# Altium project core.PrjPcb
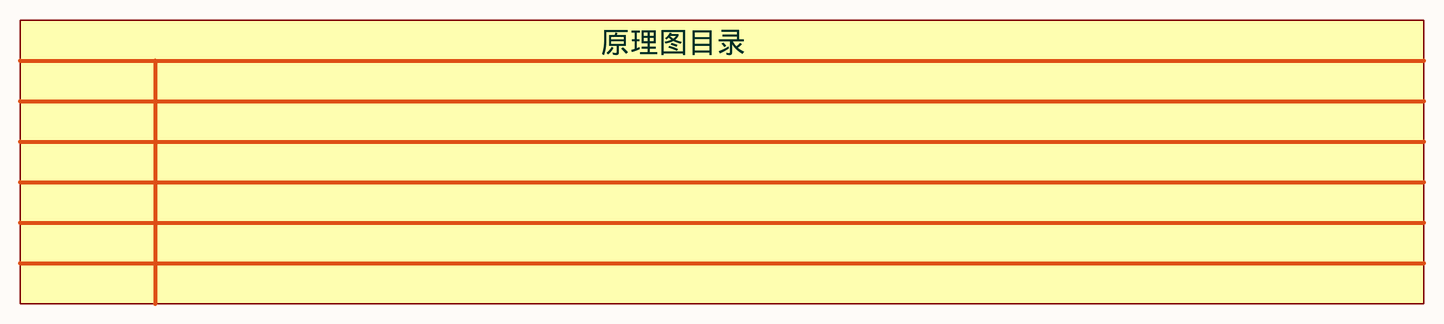
[diagram p0: MYBOARD_01-Contents.SchDoc]
5 sheets, 166 parts. Net scope: flat (ports and power ports of the same name join across sheets).
Board file: MYBOARD.PcbDoc
Sheets:
  MYBOARD_01-Contents.SchDoc
  MYBOARD_02-Power Diagram.SchDoc
  MYBOARD_03-CORE&SRAM.SchDoc
  MYBOARD_04-Other Function.SchDoc
  MYBOARD_05-PWR.SchDoc

## Sheet MYBOARD_01-Contents.SchDoc
size C

### Notes on the sheet
- 原理图目录

## Sheet MYBOARD_02-Power Diagram.SchDoc
size C
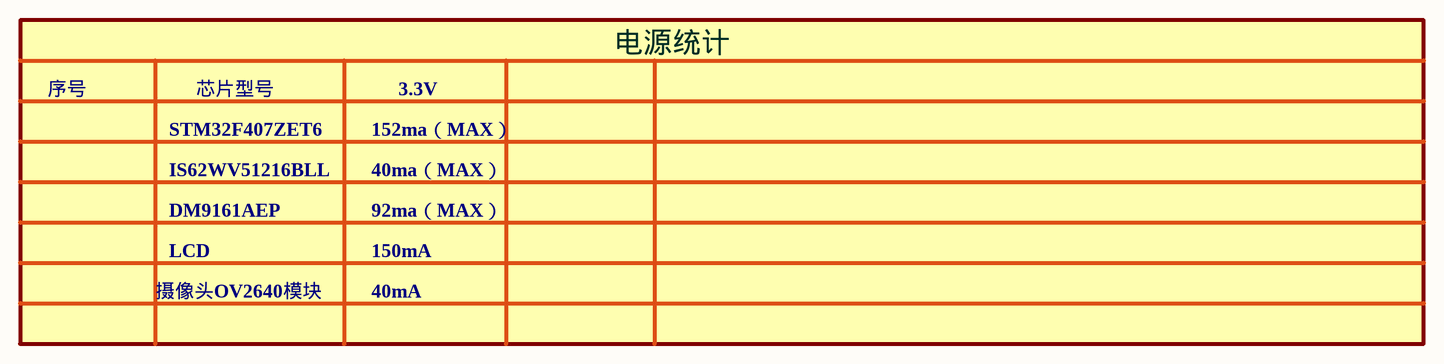
[diagram p1: MYBOARD_02-Power Diagram.SchDoc]

### Notes on the sheet
- 序号
- 芯片型号
- 3.3V
- 电源统计
- STM32F407ZET6
- 152ma（MAX）
- IS62WV51216BLL
- DM9161AEP
- 40ma（MAX）
- 92ma（MAX）
- 摄像头OV2640模块
- LCD
- 150mA
- 40mA

## Sheet MYBOARD_03-CORE&SRAM.SchDoc
size C
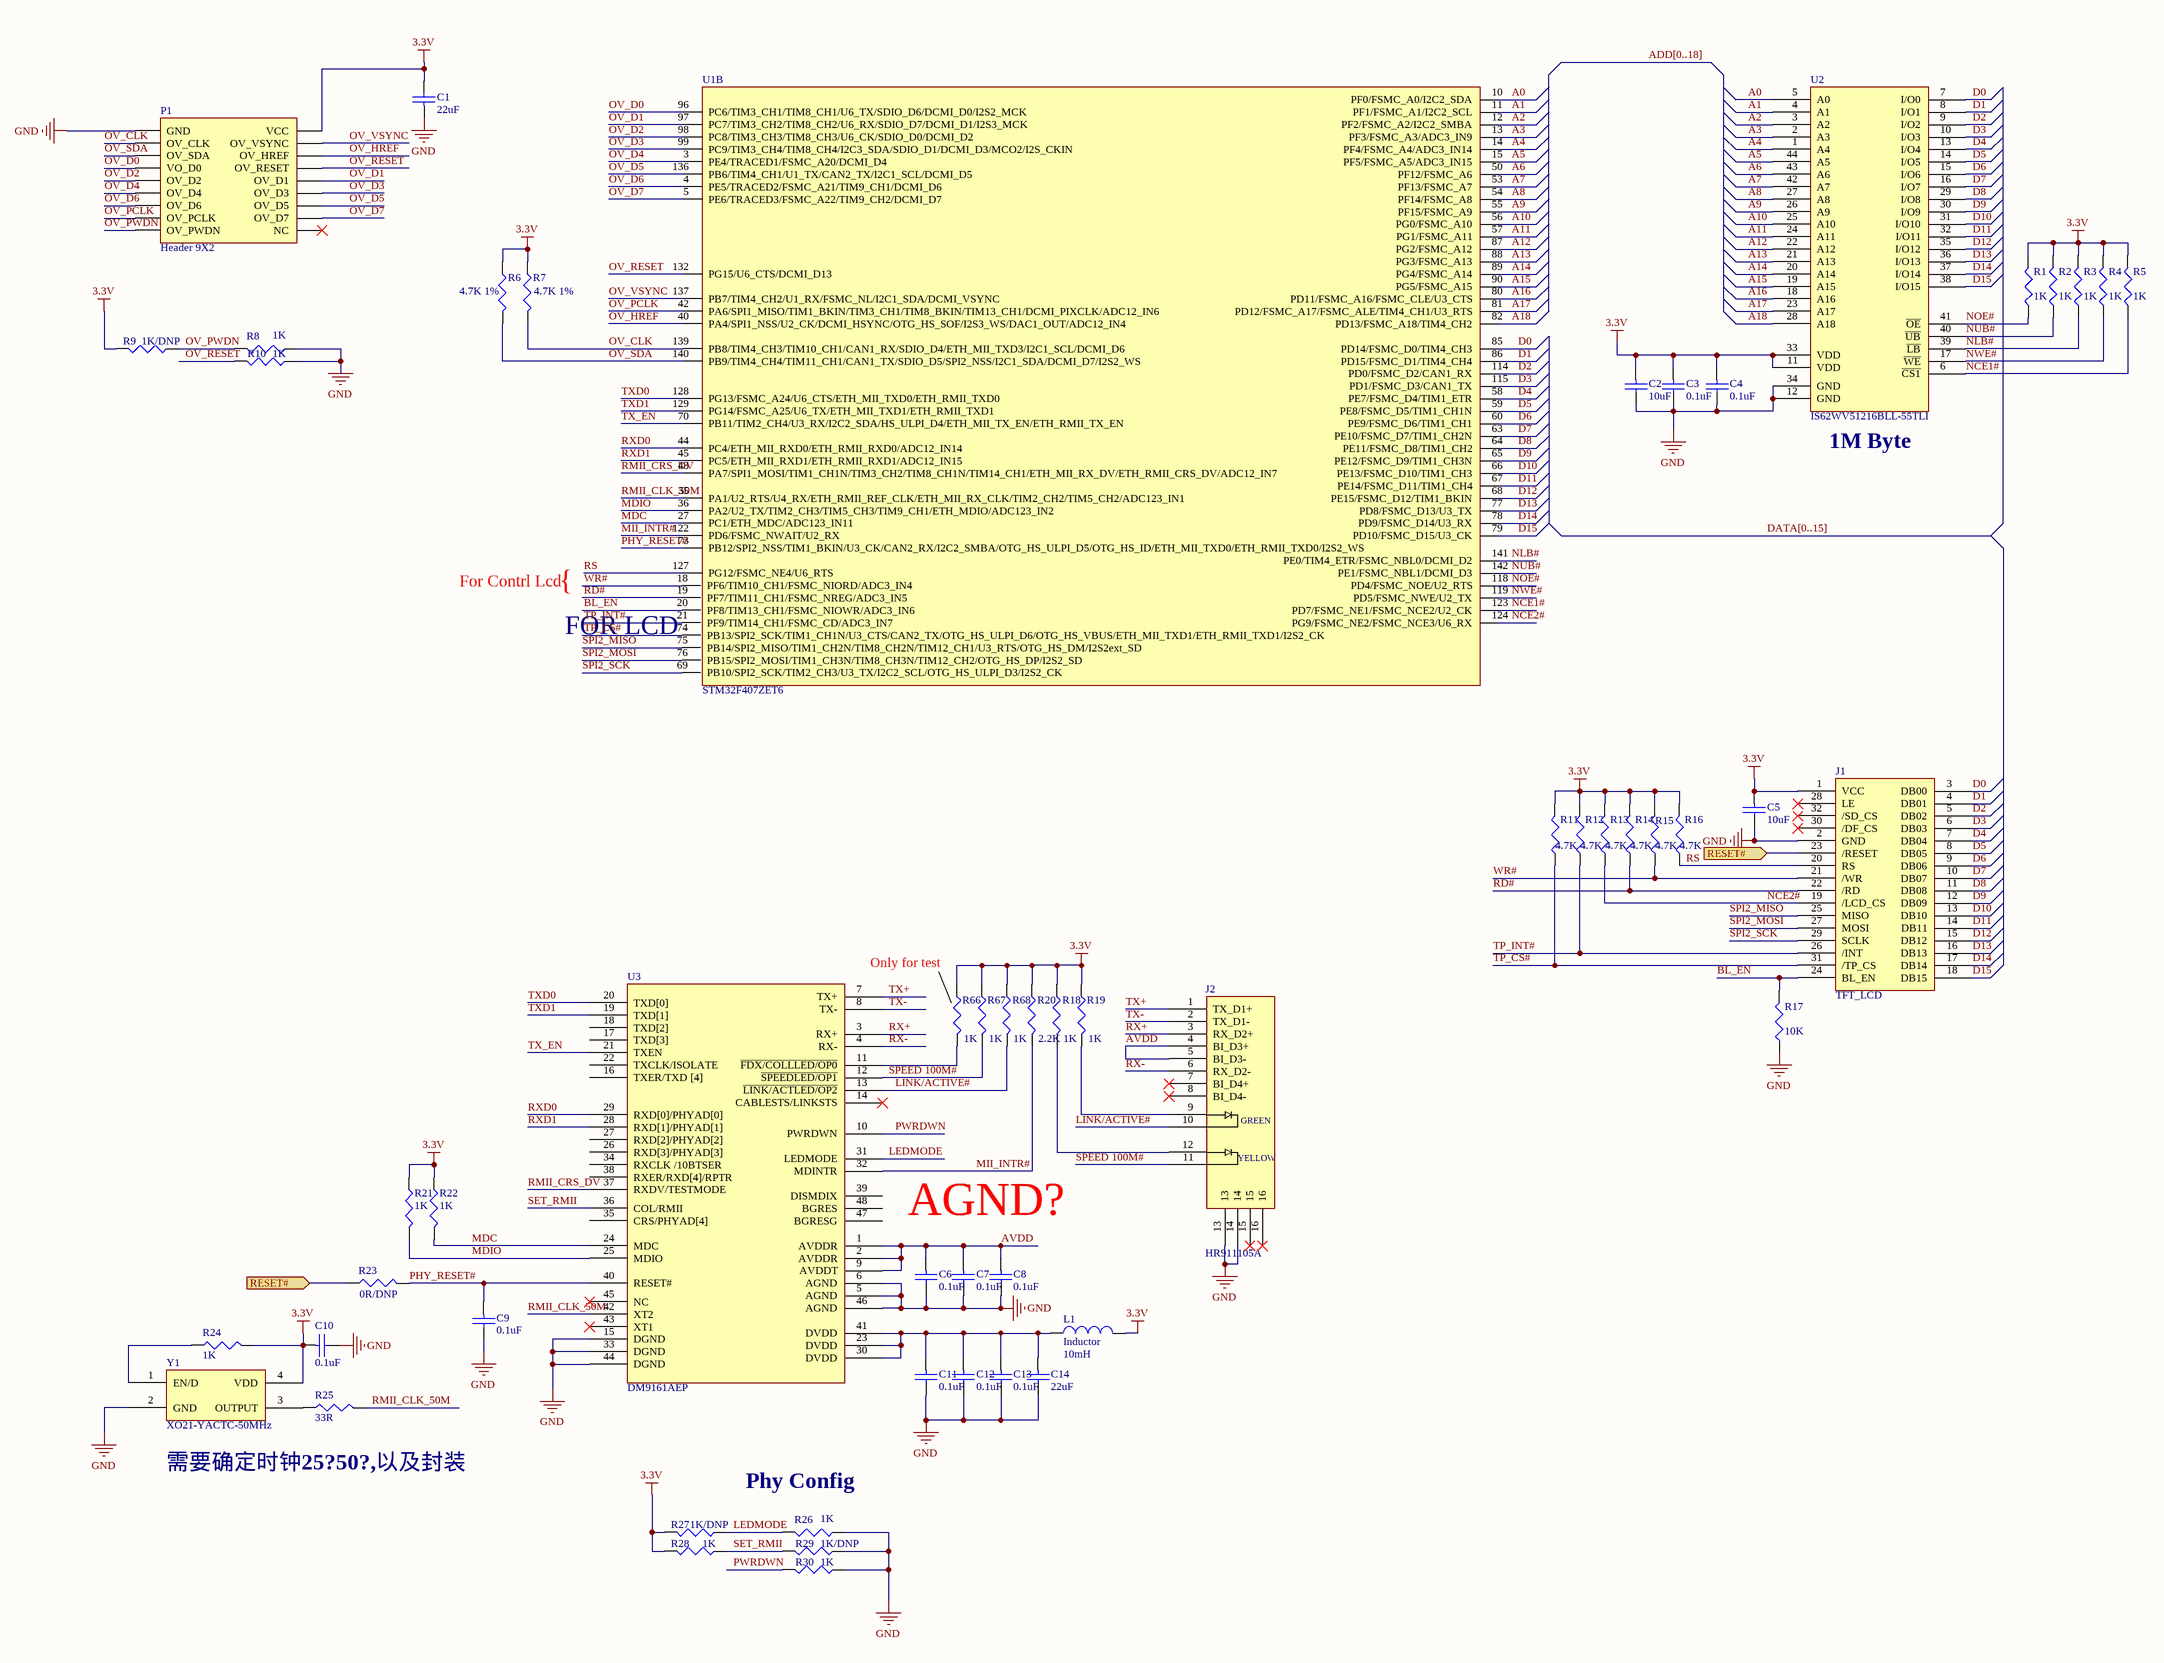
[diagram p2: MYBOARD_03-CORE&SRAM.SchDoc]

### Parts
C1  22uF  [C1206]
C2  10uF  [C0603_DWS]
C3  0.1uF  [C0603_DWS]
C4  0.1uF  [C0603_DWS]
C5  10uF  [C0603_DWS]
C6  0.1uF  [C0603_DWS]
C7  0.1uF  [C0603_DWS]
C8  0.1uF  [C0603_DWS]
C9  0.1uF  [C0603_DWS]
C10  0.1uF  [C0603_DWS]
C11  0.1uF  [C0603_DWS]
C12  0.1uF  [C0603_DWS]
C13  0.1uF  [C0603_DWS]
C14  22uF  [C1206]
J1  TFT_LCD  [TFT LCD]
J2  HR911105A  [HR911105A]
L1  Inductor  value 10mH  [0603]
P1  Header 9X2  [HDR2X9]
R1  value 1K  [R0603_5MIL_DWS]  (hidden comment: Res3)
R2  value 1K  [R0603_5MIL_DWS]  (hidden comment: Res3)
R3  value 1K  [R0603_5MIL_DWS]  (hidden comment: Res3)
R4  value 1K  [R0603_5MIL_DWS]  (hidden comment: Res3)
R5  value 1K  [R0603_5MIL_DWS]  (hidden comment: Res3)
R6  value 4.7K 1%  [R0603_5MIL_DWS]  (hidden comment: Res3)
R7  value 4.7K 1%  [R0603_5MIL_DWS]  (hidden comment: Res3)
R8  value 1K  [R0603_5MIL_DWS]  (hidden comment: Res3)
R9  value 1K/DNP  [R0603_5MIL_DWS]  (hidden comment: Res3)
R10  value 1K  [R0603_5MIL_DWS]  (hidden comment: Res3)
R11  value 4.7K  [R0603_5MIL_DWS]  (hidden comment: Res3)
R12  value 4.7K  [R0603_5MIL_DWS]  (hidden comment: Res3)
R13  value 4.7K  [R0603_5MIL_DWS]  (hidden comment: Res3)
R14  value 4.7K  [R0603_5MIL_DWS]  (hidden comment: Res3)
R15  value 4.7K  [R0603_5MIL_DWS]  (hidden comment: Res3)
R16  value 4.7K  [R0603_5MIL_DWS]  (hidden comment: Res3)
R17  value 10K  [R0603_5MIL_DWS]  (hidden comment: Res3)
R18  value 1K  [R0603_5MIL_DWS]  (hidden comment: Res3)
R19  value 1K  [R0603_5MIL_DWS]  (hidden comment: Res3)
R20  value 2.2K  [R0603_5MIL_DWS]  (hidden comment: Res3)
R21  value 1K  [R0603_5MIL_DWS]  (hidden comment: Res3)
R22  value 1K  [R0603_5MIL_DWS]  (hidden comment: Res3)
R23  value 0R/DNP  [R0603_5MIL_DWS]  (hidden comment: Res3)
R24  value 1K  [R0603_5MIL_DWS]  (hidden comment: Res3)
R25  value 33R  [R0603_5MIL_DWS]  (hidden comment: Res3)
R26  value 1K  [R0603_5MIL_DWS]  (hidden comment: Res3)
R27  value 1K/DNP  [R0603_5MIL_DWS]  (hidden comment: Res3)
R28  value 1K  [R0603_5MIL_DWS]  (hidden comment: Res3)
R29  value 1K/DNP  [R0603_5MIL_DWS]  (hidden comment: Res3)
R30  value 1K  [R0603_5MIL_DWS]  (hidden comment: Res3)
R66  value 1K  [R0603_5MIL_DWS]  (hidden comment: Res3)
R67  value 1K  [R0603_5MIL_DWS]  (hidden comment: Res3)
R68  value 1K  [R0603_5MIL_DWS]  (hidden comment: Res3)
U1  STM32F407ZET6  [LQFP144]  (part B of 3)
U2  IS62WV51216BLL-55TLI  [TSOP80P1180X120-44N]
U3  DM9161AEP  [LQFP-48]
Y1  XO21-YACTC-50MHz  [XO75]

### Ports
RESET#

### Nets
3.3V: C1.2 C2.1 C3.1 C4.1 C5.1 C10.1 J1.1(VCC) L1.2 P1.2(VCC) R1.2 R2.2 R3.2 R4.2 R5.2 R6.1 R7.1 R9.2 R11.2 R12.2 R13.2 R14.2 R15.2 R16.2 R18.1 R19.1 R20.1 R21.1 R22.1 R24.2 R27.2 R28.2 R66.1 R67.1 R68.1 U2.11(VDD) U2.33(VDD) Y1.4(VDD)
GND: C1.1 C2.2 C3.2 C4.2 C5.2 C6.2 C7.2 C8.2 C9.2 C10.2 C11.2 C12.2 C13.2 C14.2 J1.2(GND) J2.13 J2.14 P1.1(GND) R8.1 R10.1 R17.1 R26.1 R29.1 R30.1 U2.12(GND) U2.34(GND) U3.5(AGND) U3.6(AGND) U3.15(DGND) U3.33(DGND) U3.44(DGND) U3.46(AGND) Y1.2(GND)
A0: U1.10(PF0/FSMC_A0/I2C2_SDA) U2.5(A0)
A1: U1.11(PF1/FSMC_A1/I2C2_SCL) U2.4(A1)
A2: U1.12(PF2/FSMC_A2/I2C2_SMBA) U2.3(A2)
A3: U1.13(PF3/FSMC_A3/ADC3_IN9) U2.2(A3)
A4: U1.14(PF4/FSMC_A4/ADC3_IN14) U2.1(A4)
A5: U1.15(PF5/FSMC_A5/ADC3_IN15) U2.44(A5)
A6: U1.50(PF12/FSMC_A6) U2.43(A6)
A7: U1.53(PF13/FSMC_A7) U2.42(A7)
A8: U1.54(PF14/FSMC_A8) U2.27(A8)
A9: U1.55(PF15/FSMC_A9) U2.26(A9)
A10: U1.56(PG0/FSMC_A10) U2.25(A10)
A11: U1.57(PG1/FSMC_A11) U2.24(A11)
A12: U1.87(PG2/FSMC_A12) U2.22(A12)
A13: U1.88(PG3/FSMC_A13) U2.21(A13)
A14: U1.89(PG4/FSMC_A14) U2.20(A14)
A15: U1.90(PG5/FSMC_A15) U2.19(A15)
A16: U1.80(PD11/FSMC_A16/FSMC_CLE/U3_CTS) U2.18(A16)
A17: U1.81(PD12/FSMC_A17/FSMC_ALE/TIM4_CH1/U3_RTS) U2.23(A17)
A18: U1.82(PD13/FSMC_A18/TIM4_CH2) U2.28(A18)
AVDD: C6.1 C7.1 C8.1 J2.4(BI_D3+) J2.5(BI_D3-) U3.1(AVDDR) U3.2(AVDDR) U3.9(AVDDT)
BL_EN: J1.24(BL_EN) R17.2 U1.20(PF8/TIM13_CH1/FSMC_NIOWR/ADC3_IN6)
D0: J1.3(DB00) U1.85(PD14/FSMC_D0/TIM4_CH3) U2.7(I/O0)
D1: J1.4(DB01) U1.86(PD15/FSMC_D1/TIM4_CH4) U2.8(I/O1)
D2: J1.5(DB02) U1.114(PD0/FSMC_D2/CAN1_RX) U2.9(I/O2)
D3: J1.6(DB03) U1.115(PD1/FSMC_D3/CAN1_TX) U2.10(I/O3)
D4: J1.7(DB04) U1.58(PE7/FSMC_D4/TIM1_ETR) U2.13(I/O4)
D5: J1.8(DB05) U1.59(PE8/FSMC_D5/TIM1_CH1N) U2.14(I/O5)
D6: J1.9(DB06) U1.60(PE9/FSMC_D6/TIM1_CH1) U2.15(I/O6)
D7: J1.10(DB07) U1.63(PE10/FSMC_D7/TIM1_CH2N) U2.16(I/O7)
D8: J1.11(DB08) U1.64(PE11/FSMC_D8/TIM1_CH2) U2.29(I/O8)
D9: J1.12(DB09) U1.65(PE12/FSMC_D9/TIM1_CH3N) U2.30(I/O9)
D10: J1.13(DB10) U1.66(PE13/FSMC_D10/TIM1_CH3) U2.31(I/O10)
D11: J1.14(DB11) U1.67(PE14/FSMC_D11/TIM1_CH4) U2.32(I/O11)
D12: J1.15(DB12) U1.68(PE15/FSMC_D12/TIM1_BKIN) U2.35(I/O12)
D13: J1.16(DB13) U1.77(PD8/FSMC_D13/U3_TX) U2.36(I/O13)
D14: J1.17(DB14) U1.78(PD9/FSMC_D14/U3_RX) U2.37(I/O14)
D15: J1.18(DB15) U1.79(PD10/FSMC_D15/U3_CK) U2.38(I/O15)
LEDMODE: R26.2 R27.1 U3.31(LEDMODE)
LINK/ACTIVE#: J2.10 R68.2 U3.13(~{LINK/ACTLED/OP2})
MDC: R22.2 U1.27(PC1/ETH_MDC/ADC123_IN11) U3.24(MDC)
MDIO: R21.2 U1.36(PA2/U2_TX/TIM2_CH3/TIM5_CH3/TIM9_CH1/ETH_MDIO/ADC123_IN2) U3.25(MDIO)
MII_INTR#: R20.2 U1.122(PD6/FSMC_NWAIT/U2_RX) U3.32(MDINTR)
NCE1#: R5.1 U1.123(PD7/FSMC_NE1/FSMC_NCE2/U2_CK) U2.6(~{CS1})
NCE2#: J1.19(/LCD_CS) R13.1 U1.124(PG9/FSMC_NE2/FSMC_NCE3/U6_RX)
NLB#: R3.1 U1.141(PE0/TIM4_ETR/FSMC_NBL0/DCMI_D2) U2.39(~{LB})
NOE#: R1.1 U1.118(PD4/FSMC_NOE/U2_RTS) U2.41(~{OE})
NUB#: R2.1 U1.142(PE1/FSMC_NBL1/DCMI_D3) U2.40(~{UB})
NWE#: R4.1 U1.119(PD5/FSMC_NWE/U2_TX) U2.17(~{WE})
OV_CLK: P1.3(OV_CLK) R7.2 U1.139(PB8/TIM4_CH3/TIM10_CH1/CAN1_RX/SDIO_D4/ETH_MII_TXD3/I2C1_SCL/DCMI_D6)
OV_D0: P1.7(VO_D0) U1.96(PC6/TIM3_CH1/TIM8_CH1/U6_TX/SDIO_D6/DCMI_D0/I2S2_MCK)
OV_D1: P1.10(OV_D1) U1.97(PC7/TIM3_CH2/TIM8_CH2/U6_RX/SDIO_D7/DCMI_D1/I2S3_MCK)
OV_D2: P1.9(OV_D2) U1.98(PC8/TIM3_CH3/TIM8_CH3/U6_CK/SDIO_D0/DCMI_D2)
OV_D3: P1.12(OV_D3) U1.99(PC9/TIM3_CH4/TIM8_CH4/I2C3_SDA/SDIO_D1/DCMI_D3/MCO2/I2S_CKIN)
OV_D4: P1.11(OV_D4) U1.3(PE4/TRACED1/FSMC_A20/DCMI_D4)
OV_D5: P1.14(OV_D5) U1.136(PB6/TIM4_CH1/U1_TX/CAN2_TX/I2C1_SCL/DCMI_D5)
OV_D6: P1.13(OV_D6) U1.4(PE5/TRACED2/FSMC_A21/TIM9_CH1/DCMI_D6)
OV_D7: P1.16(OV_D7) U1.5(PE6/TRACED3/FSMC_A22/TIM9_CH2/DCMI_D7)
OV_HREF: P1.6(OV_HREF) U1.40(PA4/SPI1_NSS/U2_CK/DCMI_HSYNC/OTG_HS_SOF/I2S3_WS/DAC1_OUT/ADC12_IN4)
OV_PCLK: P1.15(OV_PCLK) U1.42(PA6/SPI1_MISO/TIM1_BKIN/TIM3_CH1/TIM8_BKIN/TIM13_CH1/DCMI_PIXCLK/ADC12_IN6)
OV_PWDN: P1.17(OV_PWDN) R8.2 R9.1
OV_RESET: P1.8(OV_RESET) R10.2 U1.132(PG15/U6_CTS/DCMI_D13)
OV_SDA: P1.5(OV_SDA) R6.2 U1.140(PB9/TIM4_CH4/TIM11_CH1/CAN1_TX/SDIO_D5/SPI2_NSS/I2C1_SDA/DCMI_D7/I2S2_WS)
OV_VSYNC: P1.4(OV_VSYNC) U1.137(PB7/TIM4_CH2/U1_RX/FSMC_NL/I2C1_SDA/DCMI_VSYNC)
PHY_RESET#: C9.1 R23.2 U1.73(PB12/SPI2_NSS/TIM1_BKIN/U3_CK/CAN2_RX/I2C2_SMBA/OTG_HS_ULPI_D5/OTG_HS_ID/ETH_MII_TXD0/ETH_RMII_TXD0/I2S2_WS) U3.40(RESET#)
PWRDWN: R30.2 U3.10(PWRDWN)
RD#: J1.22(/RD) R14.1 U1.19(PF7/TIM11_CH1/FSMC_NREG/ADC3_IN5)
RESET#: J1.23(/RESET) R23.1 ; port RESET#
RMII_CLK_50M: R25.2 U1.35(PA1/U2_RTS/U4_RX/ETH_RMII_REF_CLK/ETH_MII_RX_CLK/TIM2_CH2/TIM5_CH2/ADC123_IN1) U3.42(XT2)
RMII_CRS_DV: U1.43(PA7/SPI1_MOSI/TIM1_CH1N/TIM3_CH2/TIM8_CH1N/TIM14_CH1/ETH_MII_RX_DV/ETH_RMII_CRS_DV/ADC12_IN7) U3.37(RXDV/TESTMODE)
RS: J1.20(RS) R16.1 U1.127(PG12/FSMC_NE4/U6_RTS)
RX+: J2.3(RX_D2+) U3.3(RX+)
RX-: J2.6(RX_D2-) U3.4(RX-)
RXD0: U1.44(PC4/ETH_MII_RXD0/ETH_RMII_RXD0/ADC12_IN14) U3.29(RXD[0]/PHYAD[0])
RXD1: U1.45(PC5/ETH_MII_RXD1/ETH_RMII_RXD1/ADC12_IN15) U3.28(RXD[1]/PHYAD[1])
SET_RMII: R28.1 R29.2 U3.36(COL/RMII)
SPEED 100M#: J2.11 R67.2 U3.12(~{SPEEDLED/OP1})
SPI2_MISO: J1.25(MISO) U1.75(PB14/SPI2_MISO/TIM1_CH2N/TIM8_CH2N/TIM12_CH1/U3_RTS/OTG_HS_DM/I2S2ext_SD)
SPI2_MOSI: J1.27(MOSI) U1.76(PB15/SPI2_MOSI/TIM1_CH3N/TIM8_CH3N/TIM12_CH2/OTG_HS_DP/I2S2_SD)
SPI2_SCK: J1.29(SCLK) U1.69(PB10/SPI2_SCK/TIM2_CH3/U3_TX/I2C2_SCL/OTG_HS_ULPI_D3/I2S2_CK)
TP_CS#: J1.31(/TP_CS) R11.1 U1.74(PB13/SPI2_SCK/TIM1_CH1N/U3_CTS/CAN2_TX/OTG_HS_ULPI_D6/OTG_HS_VBUS/ETH_MII_TXD1/ETH_RMII_TXD1/I2S2_CK)
TP_INT#: J1.26(/INT) R12.1 U1.21(PF9/TIM14_CH1/FSMC_CD/ADC3_IN7)
TX+: J2.1(TX_D1+) U3.7(TX+)
TX-: J2.2(TX_D1-) U3.8(TX-)
TX_EN: U1.70(PB11/TIM2_CH4/U3_RX/I2C2_SDA/HS_ULPI_D4/ETH_MII_TX_EN/ETH_RMII_TX_EN) U3.21(TXEN)
TXD0: U1.128(PG13/FSMC_A24/U6_CTS/ETH_MII_TXD0/ETH_RMII_TXD0) U3.20(TXD[0])
TXD1: U1.129(PG14/FSMC_A25/U6_TX/ETH_MII_TXD1/ETH_RMII_TXD1) U3.19(TXD[1])
WR#: J1.21(/WR) R15.1 U1.18(PF6/TIM10_CH1/FSMC_NIORD/ADC3_IN4)
NetC11_1: C11.1 C12.1 C13.1 C14.1 L1.1 U3.23(DVDD) U3.30(DVDD) U3.41(DVDD)
NetJ2_9: J2.9 R19.2
NetJ2_12: J2.12 R18.2
NetR24_1: R24.1 Y1.1(EN/D)
NetR25_1: R25.1 Y1.3(OUTPUT)
NetR66_2: R66.2 U3.11(~{FDX/COLLLED/}~{OP0})

Not connected (* = marked no-connect by the designer): J1 28(LE)* 30(/DF_CS)* 32(/SD_CS)*; J2 7(BI_D4+)* 8(BI_D4-)* 15* 16*; P1 18(NC)*; U3 14(CABLESTS/LINKSTS)* 16(TXER/TXD_[4]) 17(TXD[3]) 18(TXD[2]) 22(TXCLK/ISOLATE) 26(RXD[3]/PHYAD[3]) 27(RXD[2]/PHYAD[2]) 34(RXCLK_/10BTSER) 35(CRS/PHYAD[4]) 38(RXER/RXD[4]/RPTR) 39(DISMDIX) 43(XT1)* 45(NC)* 47(BGRESG) 48(BGRES)

### Buses and harness runs
bus ADD[0..18]
bus DATA[0..15]

### Notes on the sheet
- (near U2) 1M Byte
- For Contrl Lcd
- {
- FOR LCD
- Only for test
- AGND?
- 需要确定时钟25?50?,以及封装
- Phy Config
- (in symbol RJ45,10/100 Base -TX,有变压器) GREEN; YELLOW

### Library data of the parts
C1-C14 = CAP: Capacitor
J1 = TFT_LCD: 320x240,32PIN,
J2 = RJ45,10/100 Base -TX,有变压器
L1 = Inductor: Code_IEC: 1005; Published: 8-Jun-2000; LatestRevisionDate: 29-May-2009; LatestRevisionNote: IPC-7351 Footprint Added.; PackageReference: 0402-A; Publisher: Altium Limited; PackageDescription: Chip Inductor; Code_JEITA: 0402
P1 = Header 9X2: Header, 9-Pin, Dual row; LatestRevisionDate: 17-Jul-2002; LatestRevisionNote: Re-released for DXP Platform.; Publisher: Altium Limited
R1-R30 R66-R68 = Res3: Resistor; Published: 8-Jun-2000; LatestRevisionDate: 29-May-2009; LatestRevisionNote: IPC-7351 Footprint Added.; PackageReference: J1-0603; Publisher: Altium Limited; PackageDescription: Chip Resistor
Y1 = Oscillator: 3.3V,Crystal Oscillator,25M,,Size 2.05×1.65×0.85 mm

## Sheet MYBOARD_04-Other Function.SchDoc
size B
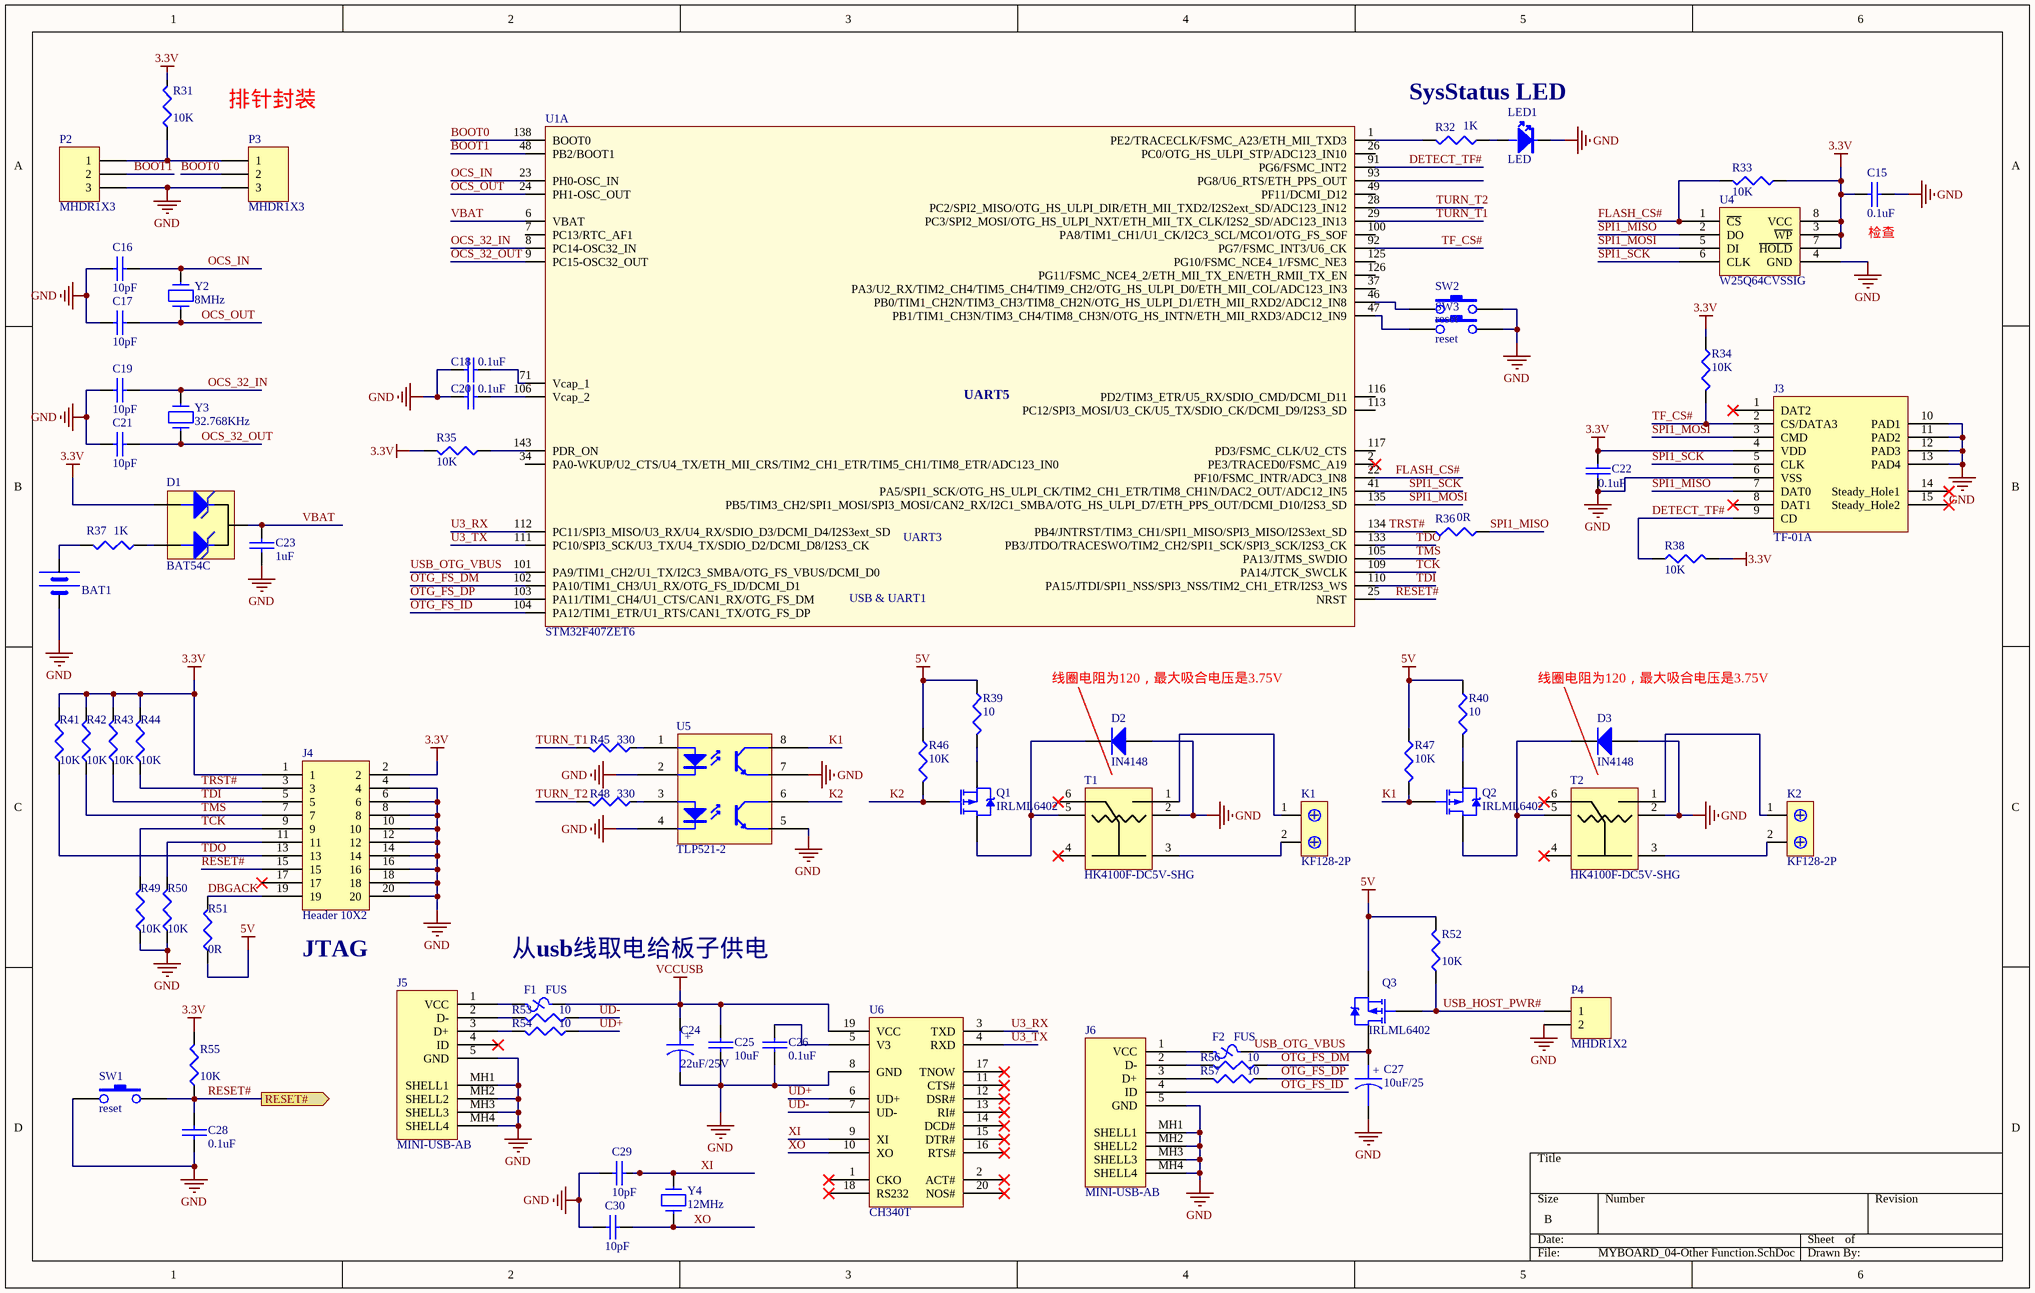
[diagram p3: MYBOARD_04-Other Function.SchDoc]

### Parts
BAT1  BATT  [BC501SM]  (value not drawn)
C15  0.1uF  [C0603_DWS]
C16  10pF  [C0603_DWS]
C17  10pF  [C0603_DWS]
C18  0.1uF  [C0603_DWS]
C19  10pF  [C0603_DWS]
C20  0.1uF  [C0603_DWS]
C21  10pF  [C0603_DWS]
C22  0.1uF  [C0603_DWS]
C23  1uF  [C0603_DWS]
C24  22uF/25V  [CAPAE7053X56M]
C25  10uF  [C0603_DWS]
C26  0.1uF  [C0603_DWS]
C27  10uF/25  [CAPAE7053X56M]
C28  0.1uF  [C0603_DWS]
C29  10pF  [C0603_DWS]
C30  10pF  [C0603_DWS]
D1  BAT54C  [BAT54C]
D2  IN4148  [1N4148WS]
D3  IN4148  [1N4148WS]
F1  FUS  [1206]
F2  FUS  [1206]
J3  TF-01A  [TF-01A]
J4  Header 10X2  [HDR2X10H]
J5  MINI-USB-AB  [MINI-B]
J6  MINI-USB-AB  [MINI-B]
K1  KF128-2P  [KF128-2P]
K2  KF128-2P  [KF128-2P]
LED1  LED  [LED-0603]
P2  MHDR1X3  [HN1X3]
P3  MHDR1X3  [HN1X3]
P4  MHDR1X2  [JP1]
Q1  IRLML6402  [SOTFL95P264X112-3N]
Q2  IRLML6402  [SOTFL95P264X112-3N]
Q3  IRLML6402  [SOTFL95P264X112-3N]
R31  value 10K  [R0603_5MIL_DWS]  (hidden comment: Res3)
R32  value 1K  [R0603_5MIL_DWS]  (hidden comment: Res3)
R33  value 10K  [R0603_5MIL_DWS]  (hidden comment: Res3)
R34  value 10K  [R0603_5MIL_DWS]  (hidden comment: Res3)
R35  value 10K  [R0603_5MIL_DWS]  (hidden comment: Res3)
R36  value 0R  [R0603_5MIL_DWS]  (hidden comment: Res3)
R37  value 1K  [R0603_5MIL_DWS]  (hidden comment: Res3)
R38  value 10K  [R0603_5MIL_DWS]  (hidden comment: Res3)
R39  value 10  [R0603_5MIL_DWS]  (hidden comment: Res3)
R40  value 10  [R0603_5MIL_DWS]  (hidden comment: Res3)
R41  value 10K  [R0603_5MIL_DWS]  (hidden comment: Res3)
R42  value 10K  [R0603_5MIL_DWS]  (hidden comment: Res3)
R43  value 10K  [R0603_5MIL_DWS]  (hidden comment: Res3)
R44  value 10K  [R0603_5MIL_DWS]  (hidden comment: Res3)
R45  value 330  [R0603_5MIL_DWS]  (hidden comment: Res3)
R46  value 10K  [R0603_5MIL_DWS]  (hidden comment: Res3)
R47  value 10K  [R0603_5MIL_DWS]  (hidden comment: Res3)
R48  value 330  [R0603_5MIL_DWS]  (hidden comment: Res3)
R49  value 10K  [R0603_5MIL_DWS]  (hidden comment: Res3)
R50  value 10K  [R0603_5MIL_DWS]  (hidden comment: Res3)
R51  value 0R  [R0603_5MIL_DWS]  (hidden comment: Res3)
R52  value 10K  [R0603_5MIL_DWS]  (hidden comment: Res3)
R53  value 10  [R0603_5MIL_DWS]  (hidden comment: Res3)
R54  value 10  [R0603_5MIL_DWS]  (hidden comment: Res3)
R55  value 10K  [R0603_5MIL_DWS]  (hidden comment: Res3)
R56  value 10  [R0603_5MIL_DWS]  (hidden comment: Res3)
R57  value 10  [R0603_5MIL_DWS]  (hidden comment: Res3)
SW1  reset  [SW-TAKT_6X3.5_SMD]
SW2  reset  [SW-TAKT_6X3.5_SMD]
SW3  reset  [SW-TAKT_6X3.5_SMD]
T1  HK4100F-DC5V-SHG  [HK4100F]
T2  HK4100F-DC5V-SHG  [HK4100F]
U1  STM32F407ZET6  [LQFP144]  (part A of 3)
U4  W25Q64CVSSIG  [SOIC-8]
U5  TLP521-2  [DIP-8]
U6  CH340T  [SSOP-20]
Y2  8MHz  [CRYSTAL22.1184_3*5 - duplicate]
Y3  32.768KHz  [CRYSTAL22.1184_3*5 - duplicate]
Y4  12MHz  [HC49/SMD2_THIN]

### Ports
RESET#

### Nets
3.3V: C15.1 C22.2 D1.1 J3.4(VDD) J4.1 J4.2 R31.2 R33.1 R34.1 R35.2 R38.2 R41.2 R42.2 R43.2 R44.2 R55.2 U4.3(~{WP}) U4.7(~{HOLD}) U4.8(VCC)
5V: Q3.2(S) R39.1 R40.1 R46.1 R47.1 R51.1 R52.2
GND: BAT1.2(GND) C15.2 C16.1 C17.1 C18.1 C19.1 C20.1 C21.1 C22.1 C23.2 C24.2 C25.2 C26.2 C27.2 C28.2 C29.1 C30.1 D2.2(A) D3.2(A) J3.6(VSS) J3.10(PAD1) J3.11(PAD2) J3.12(PAD3) J3.13(PAD4) J4.4 J4.6 J4.8 J4.10 J4.12 J4.14 J4.16 J4.18 J4.20 J5.5(GND) J5.MH1(SHELL1) J5.MH2(SHELL2) J5.MH3(SHELL3) J5.MH4(SHELL4) J6.5(GND) J6.MH1(SHELL1) J6.MH2(SHELL2) J6.MH3(SHELL3) J6.MH4(SHELL4) LED1.C P2.3 P3.3 P4.2 R49.1 R50.1 SW1.P$1 SW2.P$2 SW3.P$2 T1.2(COIL1) T2.2(COIL1) U4.4(GND) U5.2(K) U5.4(K) U5.5(E) U5.7(E) U6.8(GND)
VCCUSB: C24.1 C25.1 F1.2 U6.19(VCC)
BOOT0: P3.2 U1.138(BOOT0)
BOOT1: P2.2 U1.48(PB2/BOOT1)
DBGACK: J4.19 R51.2
DETECT_TF#: J3.9(CD) R38.1 U1.91(PG6/FSMC_INT2)
FLASH_CS#: R33.2 U1.22(PF10/FSMC_INTR/ADC3_IN8) U4.1(~{CS})
K1: Q2.1(G) R47.2 U5.8(C)
K2: Q1.1(G) R46.2 U5.6(C)
OCS_32_IN: C19.2 U1.8(PC14-OSC32_IN) Y3.2
OCS_32_OUT: C21.2 U1.9(PC15-OSC32_OUT) Y3.1
OCS_IN: C16.2 U1.23(PH0-OSC_IN) Y2.2
OCS_OUT: C17.2 U1.24(PH1-OSC_OUT) Y2.1
OTG_FS_DM: R56.1 U1.102(PA10/TIM1_CH3/U1_RX/OTG_FS_ID/DCMI_D1)
OTG_FS_DP: R57.1 U1.103(PA11/TIM1_CH4/U1_CTS/CAN1_RX/OTG_FS_DM)
OTG_FS_ID: J6.4(ID) U1.104(PA12/TIM1_ETR/U1_RTS/CAN1_TX/OTG_FS_DP)
RESET#: C28.1 J4.15 R55.1 SW1.P$2 U1.25(NRST) ; port RESET#
SPI1_MISO: J3.7(DAT0) R36.1 U4.2(DO)
SPI1_MOSI: J3.3(CMD) U1.135(PB5/TIM3_CH2/SPI1_MOSI/SPI3_MOSI/CAN2_RX/I2C1_SMBA/OTG_HS_ULPI_D7/ETH_PPS_OUT/DCMI_D10/I2S3_SD) U4.5(DI)
SPI1_SCK: J3.5(CLK) U1.41(PA5/SPI1_SCK/OTG_HS_ULPI_CK/TIM2_CH1_ETR/TIM8_CH1N/DAC2_OUT/ADC12_IN5) U4.6(CLK)
TCK: J4.9 R49.2 U1.109(PA14/JTCK_SWCLK)
TDI: J4.5 R43.1 U1.110(PA15/JTDI/SPI1_NSS/SPI3_NSS/TIM2_CH1_ETR/I2S3_WS)
TDO: J4.13 R41.1 U1.133(PB3/JTDO/TRACESWO/TIM2_CH2/SPI1_SCK/SPI3_SCK/I2S3_CK)
TF_CS#: J3.2(CS/DATA3) R34.2 U1.92(PG7/FSMC_INT3/U6_CK)
TMS: J4.7 R42.1 U1.105(PA13/JTMS_SWDIO)
TRST#: J4.3 R36.2 R44.1 U1.134(PB4/JNTRST/TIM3_CH1/SPI1_MISO/SPI3_MISO/I2S3ext_SD)
TURN_T1: R45.2 U1.29(PC3/SPI2_MOSI/OTG_HS_ULPI_NXT/ETH_MII_TX_CLK/I2S2_SD/ADC123_IN13)
TURN_T2: R48.2 U1.28(PC2/SPI2_MISO/OTG_HS_ULPI_DIR/ETH_MII_TXD2/I2S2ext_SD/ADC123_IN12)
U3_RX: U1.112(PC11/SPI3_MISO/U3_RX/U4_RX/SDIO_D3/DCMI_D4/I2S3ext_SD) U6.3(TXD)
U3_TX: U1.111(PC10/SPI3_SCK/U3_TX/U4_TX/SDIO_D2/DCMI_D8/I2S3_CK) U6.4(RXD)
UD+: R54.1 U6.6(UD+)
UD-: R53.1 U6.7(UD-)
USB_HOST_PWR#: P4.1 Q3.1(G) R52.1
USB_OTG_VBUS: C27.1 F2.2 Q3.3(D) U1.101(PA9/TIM1_CH2/U1_TX/I2C3_SMBA/OTG_FS_VBUS/DCMI_D0)
VBAT: C23.1 D1.3 U1.6(VBAT)
XI: C29.2 U6.9(XI) Y4.2
XO: C30.2 U6.10(XO) Y4.1
NetBAT1_1: BAT1.1(VCC) R37.2
NetC18_2: C18.2 U1.71(Vcap_1)
NetC20_2: C20.2 U1.106(Vcap_2)
NetC26_1: C26.1 U6.5(V3)
NetD1_2: D1.2 R37.1
NetD2_1: D2.1(K) Q1.3(D) T1.5(COIL2)
NetD3_1: D3.1(K) Q2.3(D) T2.5(COIL2)
NetF1_1: F1.1 J5.1(VCC)
NetF2_1: F2.1 J6.1(VCC)
NetJ4_11: J4.11 R50.2
NetJ5_2: J5.2(D-) R53.2
NetJ5_3: J5.3(D+) R54.2
NetJ6_2: J6.2(D-) R56.2
NetJ6_3: J6.3(D+) R57.2
NetK1_1: K1.1 T1.1(NO)
NetK1_2: K1.2 T1.3(COM)
NetK2_1: K2.1 T2.1(NO)
NetK2_2: K2.2 T2.3(COM)
NetLED1_A: LED1.A R32.1
NetP2_1: P2.1 P3.1 R31.1
NetQ1_2: Q1.2(S) R39.2
NetQ2_2: Q2.2(S) R40.2
NetR32_2: R32.2 U1.1(PE2/TRACECLK/FSMC_A23/ETH_MII_TXD3)
NetR35_1: R35.1 U1.143(PDR_ON)
NetR45_1: R45.1 U5.1(A)
NetR48_1: R48.1 U5.3(A)
NetSW2_P$1: SW2.P$1 U1.46(PB0/TIM1_CH2N/TIM3_CH3/TIM8_CH2N/OTG_HS_ULPI_D1/ETH_MII_RXD2/ADC12_IN8)
NetSW3_P$1: SW3.P$1 U1.47(PB1/TIM1_CH3N/TIM3_CH4/TIM8_CH3N/OTG_HS_INTN/ETH_MII_RXD3/ADC12_IN9)

Not connected (* = marked no-connect by the designer): J3 1(DAT2)* 8(DAT1)* 14(Steady_Hole1)* 15(Steady_Hole2)*; J4 17*; J5 4(ID)*; T1 4(COM)* 6(NC)*; T2 4(COM)* 6(NC)*; U1 2(PE3/TRACED0/FSMC_A19)* 7(PC13/RTC_AF1) 26(PC0/OTG_HS_ULPI_STP/ADC123_IN10) 34(PA0-WKUP/U2_CTS/U4_TX/ETH_MII_CRS/TIM2_CH1_ETR/TIM5_CH1/TIM8_ETR/ADC123_IN0) 37(PA3/U2_RX/TIM2_CH4/TIM5_CH4/TIM9_CH2/OTG_HS_ULPI_D0/ETH_MII_COL/ADC123_IN3) 49(PF11/DCMI_D12) 93(PG8/U6_RTS/ETH_PPS_OUT) 100(PA8/TIM1_CH1/U1_CK/I2C3_SCL/MCO1/OTG_FS_SOF) 113(PC12/SPI3_MOSI/U3_CK/U5_TX/SDIO_CK/DCMI_D9/I2S3_SD) 116(PD2/TIM3_ETR/U5_RX/SDIO_CMD/DCMI_D11) 117(PD3/FSMC_CLK/U2_CTS) 125(PG10/FSMC_NCE4_1/FSMC_NE3) 126(PG11/FSMC_NCE4_2/ETH_MII_TX_EN/ETH_RMII_TX_EN); U6 1(CKO)* 2(ACT#)* 11(CTS#)* 12(DSR#)* 13(RI#)* 14(DCD#)* 15(DTR#)* 16(RTS#)* 17(TNOW)* 18(RS232)* 20(NOS#)*

### Notes on the sheet
- SysStatus LED
- 排针封装
- (near C15) 检查
- 线圈电阻为120，最大吸合电压是3.75V
- (near J4) JTAG
- 从usb线取电给板子供电
- (in symbol CAPACITOR POL) +
- (in symbol EEE1EA100SR) +
- (in symbol STM32F407ZET6, part A) UART5; UART3; USB & UART1

### Library data of the parts
BAT1 = BAT
C15-C23 C25 C26 C28-C30 = CAP: Capacitor
C24 = CAPACITOR POL: Capacitor
C27 = EEE1EA100SR: Aluminum Electrolytic Capacitor SMD  Footprint:SizeCode_C; Manufacturer: Panasonic; Manufacturer Part Number: EEE1EA100SR
D1 = BAT54C: Diode
D2 D3 = Diode 1N914: High Conductance Fast Diode; Published: 8-Jun-2000; LatestRevisionDate: 17-Jul-2002; LatestRevisionNote: Re-released for DXP Platform.; DatasheetVersion: 1997; PackageReference: DO-35; Publisher: Altium Limited; PackageDescription: Diode, Axial; Body 3.8 x 1.9 mm (LxDia. max), Lead Dia. 0.53 mm (max); Code_JEDEC: DO-204-AH; ComponentLink1Description: Manufacturer Link; ComponentLink1URL: http://www.fairchildsemi.com/; ComponentLink2Description: Datasheet; ComponentLink2URL: http://www.fairchildsemi.com/ds/1N%2F1N4448.pdf
J3 = TF-01A: TF card socket,9pin,minisd socket,mirco sd socket,
J4 = Header 10X2: Header, 10-Pin, Dual row
J5 J6 = MINI-USB-AB: MINI USB AB 5pin SMT
K1 K2 = KF128-2P: pitch 5mm,blue, 2 pin,length 10mm
P2 P3 = MHDR1X3: Header, 3-Pin; LatestRevisionDate: 17-Jul-2002; LatestRevisionNote: Re-released for DXP Platform.; Publisher: Altium Limited
P4 = MHDR1X2: Header, 2-Pin; LatestRevisionDate: 17-Jul-2002; LatestRevisionNote: Re-released for DXP Platform.; Publisher: Altium Limited
Q1-Q3 = IRLML6401: HEXFET Power MOSFET; Published: 17-Sep-2003; DatasheetVersion: 2-Jul-2001; PackageVersion: Jul-2001; PackageReference: Micro3; Publisher: Altium Limited; PackageDescription: 3-Pin SOT-23 Package 0.95 mm Pitch, 2.3 mm Lead Span; ComponentLink1Description: Manufacturer Link; ComponentLink1URL: http://www.irf.com/; ComponentLink2Description: Datasheet; ComponentLink2URL: http://www.irf.com/product-info/datasheets/data/IRLML6401.pdf
R31-R57 = Res3: Resistor; Published: 8-Jun-2000; LatestRevisionDate: 29-May-2009; LatestRevisionNote: IPC-7351 Footprint Added.; PackageReference: J1-0603; Publisher: Altium Limited; PackageDescription: Chip Resistor
SW1-SW3 = SW-PB: 贴片按键
T1 T2 = HK4100F
U4 = W25Q64CVSSIG: 64M Bits,SOIC-8,FLASH
Y2-Y4 = CRYSTAL: 无源晶振

## Sheet MYBOARD_05-PWR.SchDoc
size A4
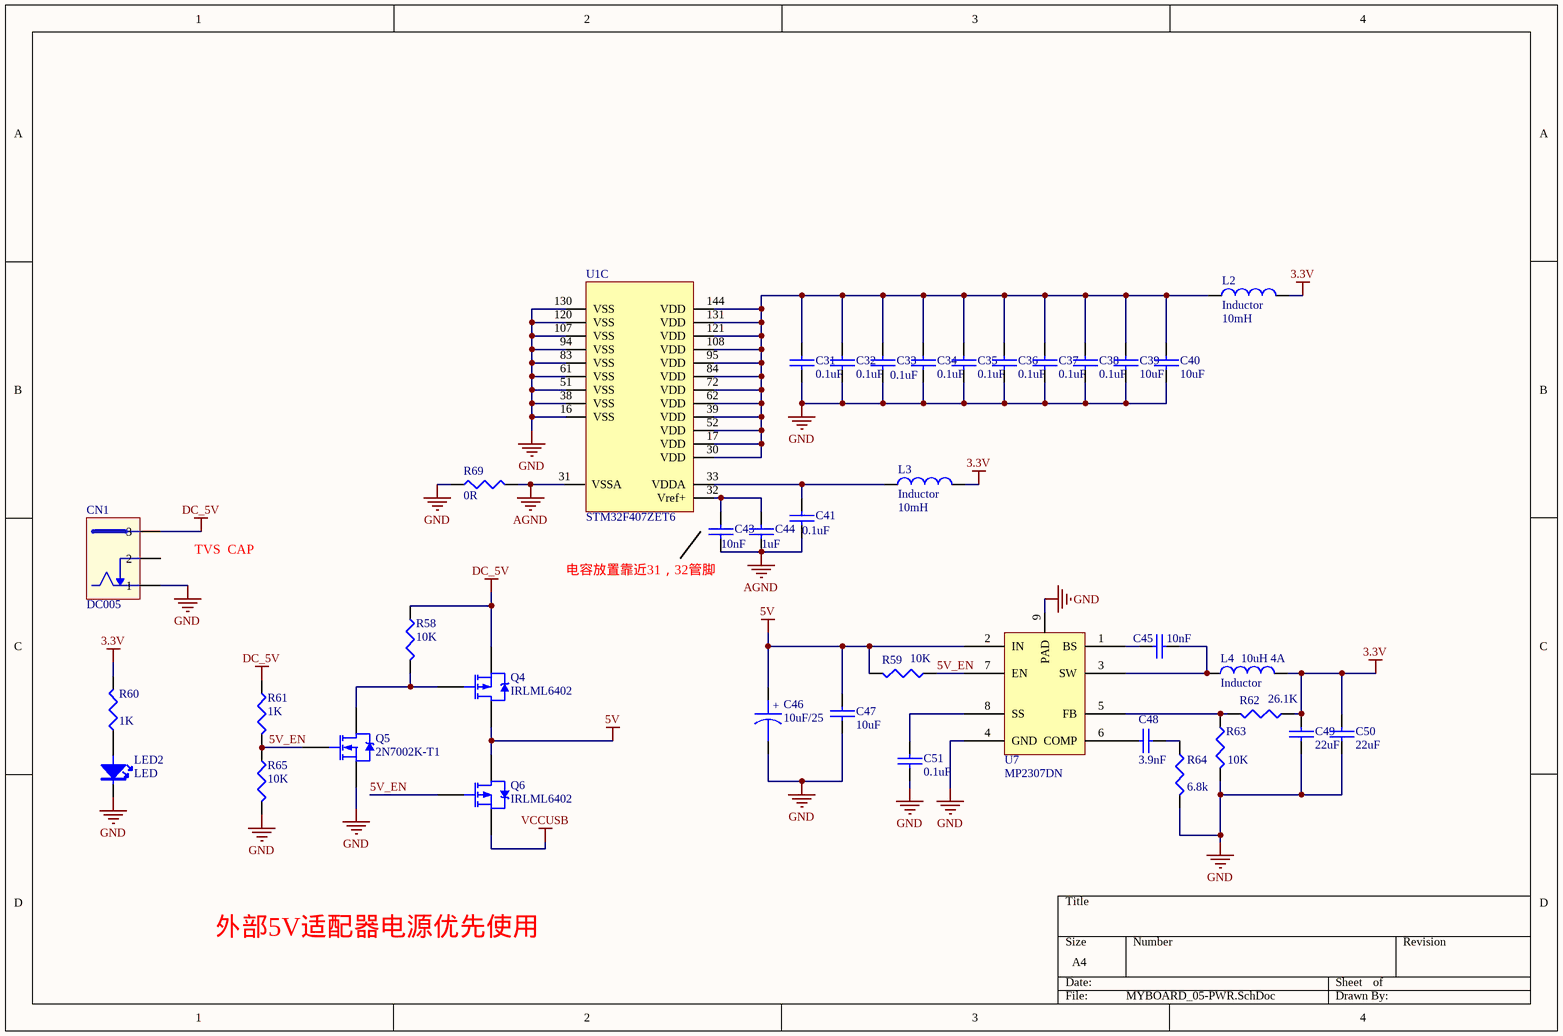
[diagram p4: MYBOARD_05-PWR.SchDoc]

### Parts
C31  0.1uF  [C0603_DWS]
C32  0.1uF  [C0603_DWS]
C33  0.1uF  [C0603_DWS]
C34  0.1uF  [C0603_DWS]
C35  0.1uF  [C0603_DWS]
C36  0.1uF  [C0603_DWS]
C37  0.1uF  [C0603_DWS]
C38  0.1uF  [C0603_DWS]
C39  10uF  [C0603_DWS]
C40  10uF  [C0603_DWS]
C41  0.1uF  [C0603_DWS]
C43  10nF  [C0603_DWS]
C44  1uF  [C0603_DWS]
C45  10nF  [C0603_DWS]
C46  10uF/25  [CAPAE7053X56M]
C47  10uF  [C1206]
C48  3.9nF  [C0603_DWS]
C49  22uF  [C1206]
C50  22uF  [C1206]
C51  0.1uF  [C0603_DWS]
CN1  DC005  [PWR_JACK_UNI_MILLING]
L2  Inductor  value 10mH  [0603]
L3  Inductor  value 10mH  [0603]
L4  Inductor  value 10uH 4A  [CD32]
LED2  LED  [LED-0603]
Q4  IRLML6402  [SOTFL95P264X112-3N]
Q5  2N7002K-T1  [SOT23]
Q6  IRLML6402  [SOTFL95P264X112-3N]
R58  value 10K  [R0603_5MIL_DWS]  (hidden comment: Res3)
R59  value 10K  [R0603_5MIL_DWS]  (hidden comment: Res3)
R60  value 1K  [R0603_5MIL_DWS]  (hidden comment: Res3)
R61  value 1K  [R0603_5MIL_DWS]  (hidden comment: Res3)
R62  value 26.1K  [R0603_5MIL_DWS]  (hidden comment: Res3)
R63  value 10K  [R0603_5MIL_DWS]  (hidden comment: Res3)
R64  value 6.8k  [R0603_5MIL_DWS]  (hidden comment: Res3)
R65  value 10K  [R0603_5MIL_DWS]  (hidden comment: Res3)
R69  value 0R  [R0603_5MIL_DWS]  (hidden comment: Res3)
U1  STM32F407ZET6  [LQFP144]  (part C of 3)
U7  MP2307DN  [SOIC-8]

### Nets
3.3V: C49.1 C50.1 L2.2 L3.2 L4.2 R60.2 R62.1
5V: C46.1 C47.1 Q4.3(D) Q6.3(D) R59.2 U7.2(IN)
AGND: C41.2 C43.2 C44.2 R69.2 U1.31(VSSA)
DC_5V: CN1.+(3) Q4.2(S) R58.1 R61.1
GND: C31.2 C32.2 C33.2 C34.2 C35.2 C36.2 C37.2 C38.2 C39.2 C40.2 C46.2 C47.2 C49.2 C50.2 C51.2 CN1.--(1) LED2.C Q5.2(S) R63.2 R64.2 R65.2 R69.1 U1.16(VSS) U1.38(VSS) U1.51(VSS) U1.61(VSS) U1.83(VSS) U1.94(VSS) U1.107(VSS) U1.120(VSS) U1.130(VSS) U7.4(GND) U7.9(PAD)
VCCUSB: Q6.2(S)
5V_EN: Q5.1(G) Q6.1(G) R59.1 R61.2 R65.1 U7.7(EN)
NetC31_1: C31.1 C32.1 C33.1 C34.1 C35.1 C36.1 C37.1 C38.1 C39.1 C40.1 L2.1 U1.17(VDD) U1.30(VDD) U1.39(VDD) U1.52(VDD) U1.62(VDD) U1.72(VDD) U1.84(VDD) U1.95(VDD) U1.108(VDD) U1.121(VDD) U1.131(VDD) U1.144(VDD)
NetC41_1: C41.1 L3.1 U1.33(VDDA)
NetC43_1: C43.1 C44.1 U1.32(Vref+)
NetC45_1: C45.1 U7.1(BS)
NetC45_2: C45.2 L4.1 U7.3(SW)
NetC48_1: C48.1 U7.6(COMP)
NetC48_2: C48.2 R64.1
NetC51_1: C51.1 U7.8(SS)
NetLED2_A: LED2.A R60.1
NetQ4_1: Q4.1(G) Q5.3(D) R58.2
NetR62_2: R62.2 R63.1 U7.5(FB)

Not connected (* = marked no-connect by the designer): CN1 -(2)

### Notes on the sheet
- TVS  CAP
- 电容放置靠近31，32管脚
- 外部5V适配器电源优先使用
- (in symbol EEE1EA100SR) +

### Library data of the parts
C31-C41 C43-C45 C47-C51 = CAP: Capacitor
C46 = EEE1EA100SR: as C27 on sheet MYBOARD_04-Other Function; Manufacturer Part Number: EEE1EA100SR
CN1 = DC005: 3pin, 5mm, DC input connect,
L2-L4 = Inductor: Code_IEC: 1005; Published: 8-Jun-2000; LatestRevisionDate: 29-May-2009; LatestRevisionNote: IPC-7351 Footprint Added.; PackageReference: 0402-A; Publisher: Altium Limited; PackageDescription: Chip Inductor; Code_JEITA: 0402
Q4 Q6 = IRLML6401: HEXFET Power MOSFET; Published: 17-Sep-2003; DatasheetVersion: 2-Jul-2001; PackageVersion: Jul-2001; PackageReference: Micro3; Publisher: Altium Limited; PackageDescription: 3-Pin SOT-23 Package 0.95 mm Pitch, 2.3 mm Lead Span; ComponentLink1Description: Manufacturer Link; ComponentLink1URL: http://www.irf.com/; ComponentLink2Description: Datasheet; ComponentLink2URL: http://www.irf.com/product-info/datasheets/data/IRLML6401.pdf
Q5 = 2N7002K-T1: N-MOS SOT-23
R58-R65 R69 = Res3: Resistor; Published: 8-Jun-2000; LatestRevisionDate: 29-May-2009; LatestRevisionNote: IPC-7351 Footprint Added.; PackageReference: J1-0603; Publisher: Altium Limited; PackageDescription: Chip Resistor
U7 = MP2307DN: DC-DC  4.75-23V INPUT SOIC-8  3A

## Nets that join several sheets
3.3V: MYBOARD_03-CORE&SRAM (37 pins), MYBOARD_04-Other Function (19 pins), MYBOARD_05-PWR (7 pins)
5V: MYBOARD_04-Other Function (7 pins), MYBOARD_05-PWR (6 pins)
GND: MYBOARD_03-CORE&SRAM (33 pins), MYBOARD_04-Other Function (60 pins), MYBOARD_05-PWR (33 pins)
VCCUSB: MYBOARD_04-Other Function (C24.1 C25.1 F1.2 U6.19), MYBOARD_05-PWR (Q6.2)
RESET#: MYBOARD_03-CORE&SRAM (J1.23 R23.1), MYBOARD_04-Other Function (5 pins)